# Altium schematic sheet BEESP_CODE_power.SchDoc
size A4
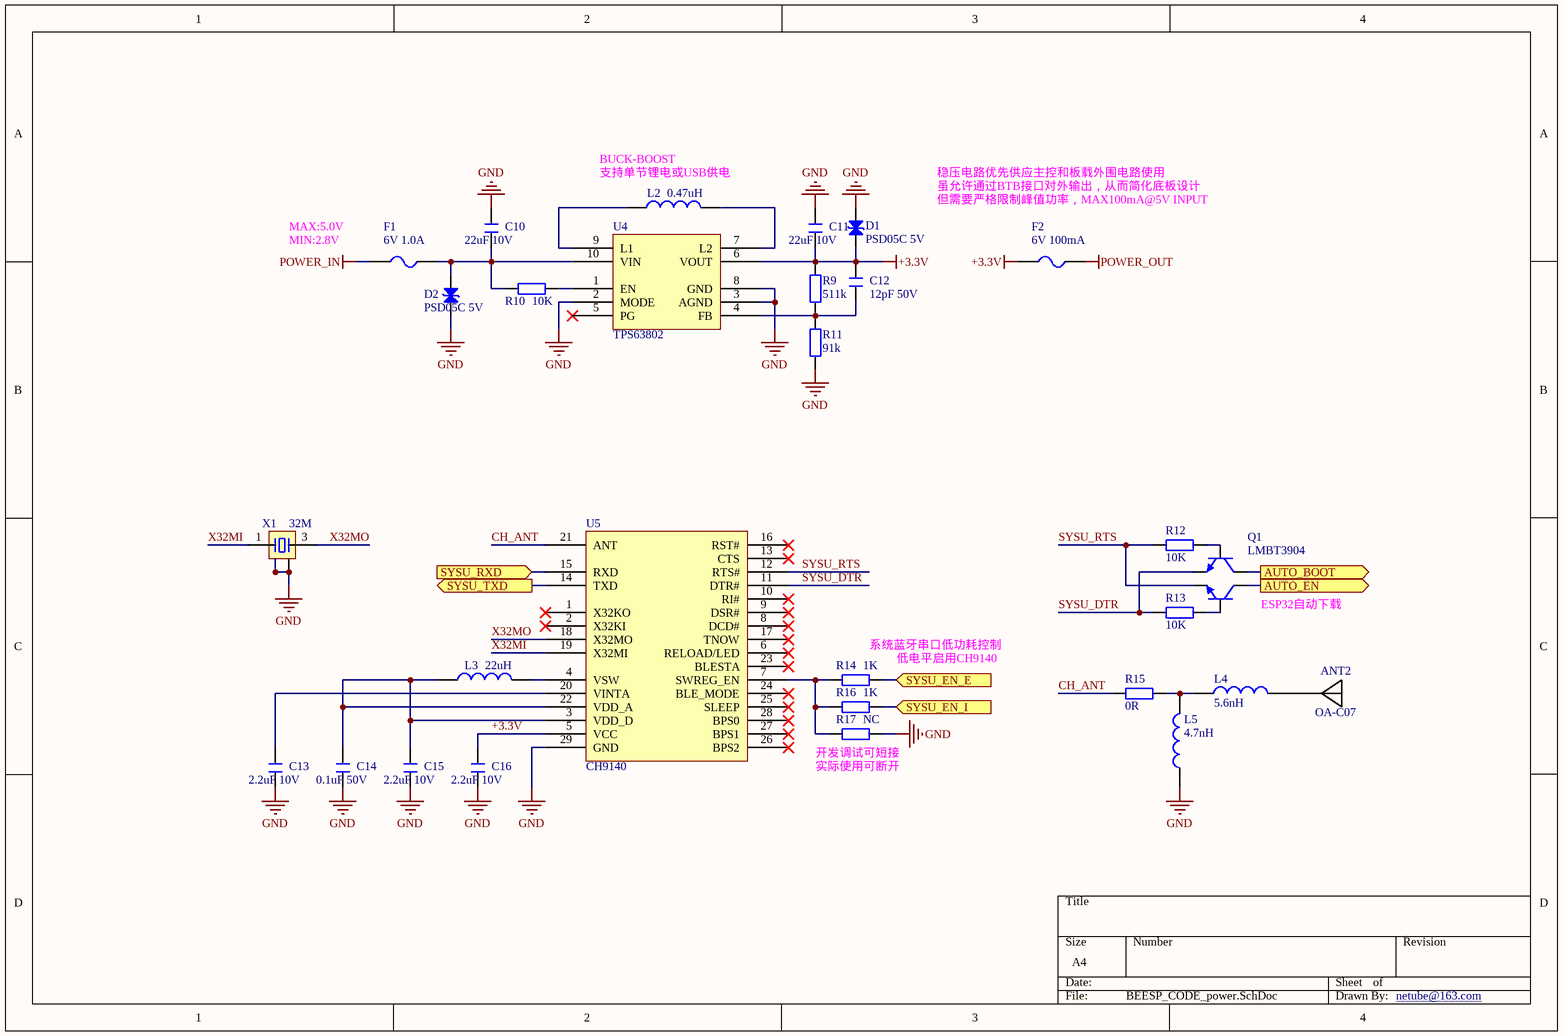
[diagram p0: BEESP_CODE_power.SchDoc]

## Parts
ANT2  OA-C07  [OA-C07]
C10  22uF 10V  [C 0603_L]
C11  22uF 10V  [C 0603_L]
C12  12pF 50V  [C 0402_L]
C13  2.2uF 10V  [C 0402_L]
C14  0.1uF 50V  [C 0402_L]
C15  2.2uF 10V  [C 0402_L]
C16  2.2uF 10V  [C 0402_L]
D1  PSD05C 5V  [SOD-323]
D2  PSD05C 5V  [SOD-323]
F1  6V 1.0A  [FU 0603]
F2  6V 100mA  [FU 0603]
L2  0.47uH  [L 0805]
L3  22uH  [R 0402_L]
L4  5.6nH  [R 0402_L]
L5  4.7nH  [R 0402_L]
Q1  LMBT3904  [SOT-363]
R9  511k  [R 0402_L]
R10  10K  [R 0402_L]
R11  91k  [R 0402_L]
R12  10K  [R 0402_L]
R13  10K  [R 0402_L]
R14  1K  [R 0402_L]
R15  0R  [R 0402_L]
R16  1K  [R 0402_L]
R17  NC  [R 0402_L]
U4  TPS63802  [VSON-10_L3.0-W2.0-P0.50-TL]
U5  CH9140  [QFN28 4*4]
X1  32M  [OSC 1612-4P]

## Ports
AUTO_BOOT (out), AUTO_EN (out), SYSU_EN_E (in), SYSU_EN_I (in), SYSU_RXD (in), SYSU_TXD (out)

## Nets
+3.3V: C11.1 C12.2 C16.1 D1.2(K) F2.1 R9.1 U4.6(VOUT) U5.5(VCC)
GND: C10.2 C11.2 C13.2 C14.2 C15.2 C16.2 D1.1(A) D2.1(A) L5.1 R11.1 R17.2 U4.2(MODE) U4.3(AGND) U4.8(GND) U5.29(GND) X1.2 X1.4
POWER_IN: F1.1
POWER_OUT: F2.2
AUTO_BOOT: Q1.3(C) ; port AUTO_BOOT
AUTO_EN: Q1.6(C) ; port AUTO_EN
CH_ANT: R15.1 U5.21(ANT)
SYSU_DTR: Q1.4(E) R13.1 U5.11(DTR#)
SYSU_EN_E: R14.2 ; port SYSU_EN_E
SYSU_EN_I: R16.2 ; port SYSU_EN_I
SYSU_RTS: Q1.1(E) R12.1 U5.12(RTS#)
SYSU_RXD: U5.15(RXD) ; port SYSU_RXD
SYSU_TXD: U5.14(TXD) ; port SYSU_TXD
X32MI: U5.19(X32MI) X1.1
X32MO: U5.18(X32MO) X1.3
NetANT2_1: ANT2.1 L4.2
NetC10_1: C10.1 D2.2(K) F1.2 R10.1 U4.10(VIN)
NetC12_1: C12.1 R9.2 R11.2 U4.4(FB)
NetC13_1: C13.1 U5.20(VINTA)
NetC14_1: C14.1 C15.1 L3.1 U5.3(VDD_D) U5.22(VDD_A)
NetL2_1: L2.1 U4.9(L1)
NetL2_2: L2.2 U4.7(L2)
NetL3_2: L3.2 U5.4(VSW)
NetL4_1: L4.1 L5.2 R15.2
NetQ1_2: Q1.2(B) R13.2
NetQ1_5: Q1.5(B) R12.2
NetR10_2: R10.2 U4.1(EN)
NetR14_1: R14.1 R16.1 R17.1 U5.7(SWREG_EN)

Not connected (* = marked no-connect by the designer): U4 5(PG)*; U5 1(X32KO)* 2(X32KI)* 6(RELOAD/LED)* 8(DCD#)* 9(DSR#)* 10(RI#)* 13(CTS)* 16(RST#)* 17(TNOW)* 23(BLESTA)* 24(BLE_MODE)* 25(SLEEP)* 26(BPS2)* 27(BPS1)* 28(BPS0)*

## Notes on the sheet
- (near L2) BUCK-BOOST
- (near L2) 支持单节锂电或USB供电
- 稳压电路优先供应主控和板载外围电路使用
- MIN:2.8V
- MAX:5.0V
- 虽允许通过BTB接口对外输出，从而简化底板设计
- 但需要严格限制峰值功率，MAX100mA@5V INPUT
- (near R14) 系统蓝牙串口低功耗控制
- (near Q1) ESP32自动下载
- 低电平启用CH9140
- (near R17) 开发调试可短接
- (near R17) 实际使用可断开
- netube@163.com

## Library data of the parts
ANT2 = ANT1: PCB板载天线; 版权归属: 封装库来自淘宝 ID：黄晶宝石; BOM名称: PCB板载天线; 技术支持，联系售后: https://shop463601444.taobao.com
C10-C16 = C: 贴片电容; BOM名称: 无极性贴片电容; 优秀评价可免费更新: 联系淘宝ID：黄晶宝石，获取更新版封装库; 卖家免费技术支持，联系售后: 唯一出售店铺网址https://shop463601444.taobao.com; 本封装库来自淘宝卖家 ID：黄晶宝石: 其他店铺购入均为盗版，请立即申请退款
D1 D2 = TVS: TVS保护; 卖家免费技术支持，联系售后: 唯一出售店铺网址https://shop463601444.taobao.com; 优秀评价可免费更新: 联系淘宝ID：黄晶宝石，获取更新版封装库; 封装库 来自淘宝卖家 ID：黄晶宝石: 其他店铺购入均为盗版，请立即申请退款; Code_JEDEC: DO-214-AB
F1 F2 = FU: 贴片保险丝; 版权归属: 封装库来自淘宝卖家 ID：黄晶宝石; 优秀评价可免费更新: 联系淘宝ID：黄晶宝石，获取更新版封装库; 卖家免费技术支持，联系售后: 唯一出售店铺网址https://shop463601444.taobao.com; 封装库来自淘宝卖家 ID：黄晶宝石: 其他店铺购入均为盗版，请立即申请退款; BOM名称: 贴片保险丝
L2-L5 = L: 小功率贴片电感; 优秀评价可免费更新: 联系淘宝ID：黄晶宝石，获取更新版封装库; 卖家免费技术支持，联系售后: 唯一出售店铺网址https://shop463601444.taobao.com; 本封装库来自淘宝卖家 ID：黄晶宝石: 其他店铺购入均为盗版，请立即申请退款; BOM名称: 小功率贴片电感
Q1 = LMBT3904: LMBT3904DW1T1G; BOM名称: 高频放大-NPN型; 属性: 40V 1.5A 1W 100MHZ; 卖家免费技术支持，联系售后: 唯一出售店铺网址https://shop463601444.taobao.com; 封装库来自淘宝卖家 ID：黄晶宝石: 其他店铺购入均为假冒，请立即申请退款，本店奖励2~5元现金
R9-R17 = R: 贴片电阻; 优秀评价可免费更新: 联系淘宝ID：黄晶宝石，获取更新版封装库; 卖家免费技术支持，联系售后: 唯一出售店铺网址https://shop463601444.taobao.com; 本封装库来自淘宝卖家 ID：黄晶宝石: 其他店铺购入均为盗版，请立即申请退款; BOM名称: 贴片电阻
X1 = XTAL-4P: 4脚无源晶振; 版权归属: 封装库来自淘宝卖家 ID：黄晶宝石; 优秀评价可免费更新: 联系淘宝ID：黄晶宝石，获取更新版封装库; 卖家免费技术支持，联系售后: 唯一出售店铺网址https://shop463601444.taobao.com; 封装库来自淘宝卖家 ID：黄晶宝石: 其他店铺购入均为盗版，请立即申请退款; BOM名称: 4脚无源晶振